# Altium schematic sheet boardPower.SchDoc
size A4
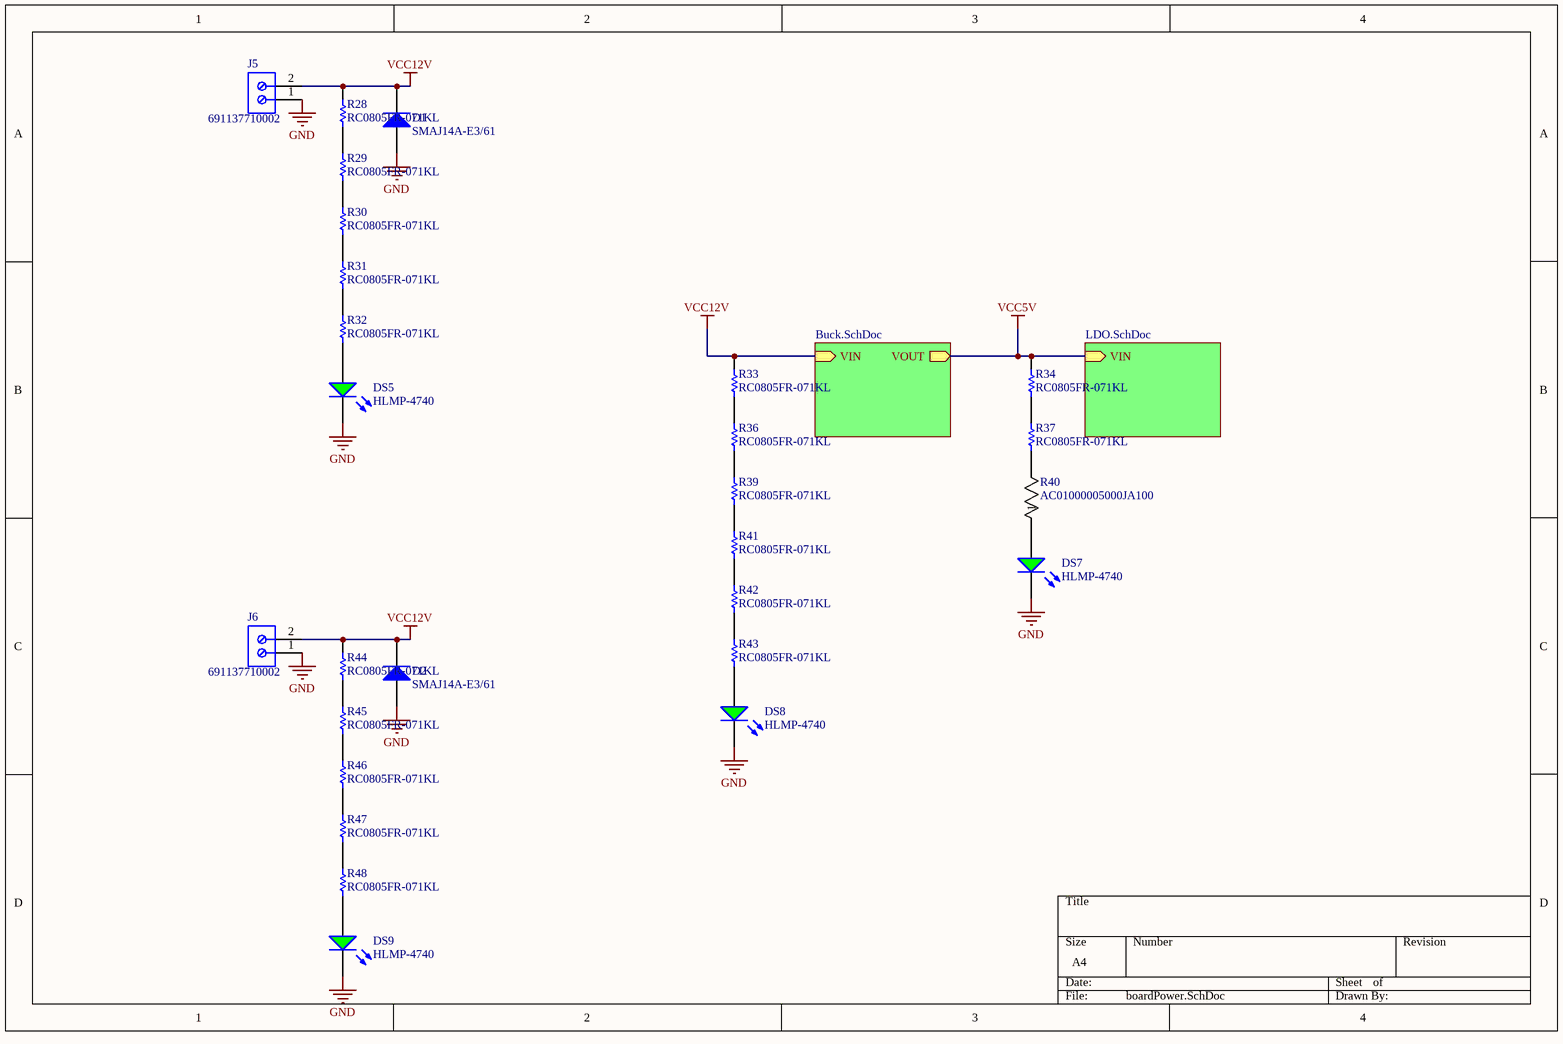
[diagram p0: boardPower.SchDoc]

## Parts
D1  SMAJ14A-E3/61  [VISH-DO-214AC-2_L]
D2  SMAJ14A-E3/61  [VISH-DO-214AC-2_L]
DS5  HLMP-4740  [AVAG-HLMP-4740]
DS7  HLMP-4740  [AVAG-HLMP-4740]
DS8  HLMP-4740  [AVAG-HLMP-4740]
DS9  HLMP-4740  [AVAG-HLMP-4740]
J5  691137710002  [691137710002]
J6  691137710002  [691137710002]
R28  RC0805FR-071KL  [RESC2013X60X35ML10T20]
R29  RC0805FR-071KL  [RESC2013X60X35ML10T20]
R30  RC0805FR-071KL  [RESC2013X60X35ML10T20]
R31  RC0805FR-071KL  [RESC2013X60X35ML10T20]
R32  RC0805FR-071KL  [RESC2013X60X35ML10T20]
R33  RC0805FR-071KL  [RESC2013X60X35ML10T20]
R34  RC0805FR-071KL  [RESC2013X60X35ML10T20]
R36  RC0805FR-071KL  [RESC2013X60X35ML10T20]
R37  RC0805FR-071KL  [RESC2013X60X35ML10T20]
R39  RC0805FR-071KL  [RESC2013X60X35ML10T20]
R40  AC01000005000JA100  [RES_AC01_VIS]
R41  RC0805FR-071KL  [RESC2013X60X35ML10T20]
R42  RC0805FR-071KL  [RESC2013X60X35ML10T20]
R43  RC0805FR-071KL  [RESC2013X60X35ML10T20]
R44  RC0805FR-071KL  [RESC2013X60X35ML10T20]
R45  RC0805FR-071KL  [RESC2013X60X35ML10T20]
R46  RC0805FR-071KL  [RESC2013X60X35ML10T20]
R47  RC0805FR-071KL  [RESC2013X60X35ML10T20]
R48  RC0805FR-071KL  [RESC2013X60X35ML10T20]

## Sub-sheets
Buck = Buck.SchDoc: VIN (in), VOUT (out)
LDO = LDO.SchDoc: VIN (in)

## Nets
GND: D1.2(A) D2.2(A) DS5.2(K) DS7.2(K) DS8.2(K) DS9.2(K) J5.1 J6.1
VCC5V: R34.2 ; sheet Buck/VOUT, sheet LDO/VIN
VCC12V: D1.1(K) D2.1(K) J5.2 J6.2 R28.2 R33.2 R44.2 ; sheet Buck/VIN
NetDS5_1: DS5.1(A) R32.1
NetDS7_1: DS7.1(A) R40.1
NetDS8_1: DS8.1(A) R43.1
NetDS9_1: DS9.1(A) R48.1
NetR28_1: R28.1 R29.2
NetR29_1: R29.1 R30.2
NetR30_1: R30.1 R31.2
NetR31_1: R31.1 R32.2
NetR33_1: R33.1 R36.2
NetR34_1: R34.1 R37.2
NetR36_1: R36.1 R39.2
NetR37_1: R37.1 R40.2
NetR39_1: R39.1 R41.2
NetR41_1: R41.1 R42.2
NetR42_1: R42.1 R43.2
NetR44_1: R44.1 R45.2
NetR45_1: R45.1 R46.2
NetR46_1: R46.1 R47.2
NetR47_1: R47.1 R48.2

## Library data of the parts
D1 D2 = CMP-0548-00224-2: Transient Voltage Suppressor, 6.40 to 231 V, 14 V Stand-off Voltage, Uni-Directional, -55 to 155 degC, 2-pin DO-214AC, Pb-Free, Tape and Reel; Manufacturer: Vishay Semiconductor; PPPM (W): 400, 300; VWM (V): 14; VBR Uni-Directional (V): 6.4 to 231; IFSM: 40 A; ID (uA): 1; PackageDescription: 2-Pin DO-214AC (SMA), Body 4.245 x 2.665 mm; ComponentLink2URL: http://www.vishay.com/docs/88390/smaj50a.pdf; Mounting Technology: Surface Mount; PartNumber: SMAJ14A-E3/61; Operating Junction and Storage Temperature Range: -55 to 150 degC; ComponentLink2Description: Datasheet; Packing: Tape and Reel; PackageReference: DO-214AC-2; ComponentLink3Description: Package Specification; ComponentLink1URL: http://www.vishay.com/; RoHS: TRUE; ComponentLink3URL: http://www.vishay.com/docs/88390/smaj50a.pdf; ComponentLink1Description: Manufacturer URL; DatasheetVersion: 12/8/2013
DS5 DS7-DS9 = CMP-2000-06413-1: T-1 3/4 (5 mm) Low Current LED Lamp, Green, 1.9 V, -20 to 100 degC, 2-Pin THD, RoHS, Bulk; Manufacturer: AvagoTechnologies; Type: Uni-Color; Peak Wavelength: 565nm; Rad Hard: No; Viewing Angle: 50°; Dominant Wavelength/Color Temperature: 569nm; Number of LEDs: 1; Lens Appearance: ColoredDiffused; Lens Shape Type: Circular; Mounting Orientation: TopMount; Intensity: 2.3mcd; Datasheet Version: 07/2014; Category: LEDs; Datasheet URL: http://docs.avagotech.com/docs/AV02-1557EN; Packaging: Bulk; Pin Count: 2; Mounting Technology: ThroughHole; Package Reference: HLMP-4740; Mounting: ThroughHole; Manufacturer URL: http://www.avagotech.com/; Color: Green; Package: 2T-13/4; Package Description: 2-Pin Through Hole Device, Dia 5.845 mm, Pitch 2.54 mm
J5 J6 = CMP-1502-03324-2: NexarPartId: 78871135; Voltage Rating: 300V; Number of Contacts: 2; Current Rating: 16A; Lead Pitch: 5mm; Height: 11.6mm; Packaging: Box; RoHS: Non-Compliant; Contact Material: Nickel, Tin; Max Operating Temperature: 120°C; Number of Pins: 2; Min Operating Temperature: -30°C; Number of Rows: 1
R28-R34 R36 R37 R39 R41-R48 = CMP-2100-03671-1: Chip Resistor, 1 KOhm, +/- 1%, 125 mW, -55 to 155 degC, 0805 (2012 Metric), RoHS, Tape and Reel; Manufacturer: Yageo; Temperature Coefficient: 100ppm/degreesC; Voltage Rating (DC): 150V; Max Power Dissipation: 125mW; Resistance: 1KOhm; Number of Pins: 2; Number of Terminations: 2; Datasheet URL: http://www.yageo.com/NewPortal/yageodocoutput?fileName=/pdf/R-Chip/PYu-RC_Group_51_RoHS_L_5.pdf; Length: 0.079inch; Package Description: 2-Pin Surface Mounted Device, Body 2 x 1.25 mm; Depth: 1.25mm; Height: 0.024inch; Military Standard: Not; Case/Package: 0805; Package Reference: 0805; RoHSCompliant: true; Lead Free: LeadFree; Packaging: TapeandReel; Package Quantity: 1; Datasheet Version: Rev. 5, 10/2016; Tolerance: 1%; Min Operating Temperature: -55degC; Voltage Rating: 150V; Composition: ThickFilm; Case Code (Imperial): 0805; Power Rating: 125mW; Width: 0.049inch; Case Code (Metric): 2012; Manufacturer URL: http://www.yageo.com/; Max Operating Temperature: 155degC; REACH SVHC: Unknown; Termination: SMD/SMT
R40 = CMP-00030-39746512-1: AC01000005000JA100 Res Wirewound 500 Ohm 5% 1W 100ppm/°C to 180ppm/°C Conformal AXL Thru-Hole Ammo Pack; Voltage Rating (DC): 22V; Lead Diameter: 800µm; Resistance: 500Ω; Weight: 519.986953mg; Number of Pins: 2; Min Operating Temperature: -40°C; Case/Package: Axial; Schedule B: 8533210080, 8533210080; Features: Flame Retardant Coating; Power Rating: 1W; Max Power Dissipation: 1W; Packaging: Tape & Box (TB); RoHS: Compliant; REACH SVHC: Unknown; NexarPartId: 39746512; Temperature Coefficient: 180ppm/°C; Diameter: 4.3mm; Contact Plating: Tin; Radiation Hardening: No; Max Operating Temperature: 275°C; Length: 11mm; Tolerance: 5%; Composition: Wirewound; Number of Terminations: 2; Termination: Axial; Voltage Rating: 22V